# EasyEDA Pro project uven2-mk3-cc-driver-20x.eprj, schematic cc-driver
Board Name: cc-driver; Create Date: 2025-05-29; Page Name: P1; Project Name: uven2-mk3-cc-driver-20x; Schematic Name: cc-driver; Update Date: 2025-06-02; Company: EasyEDA.com; Page Size: A4; Version: V1.0
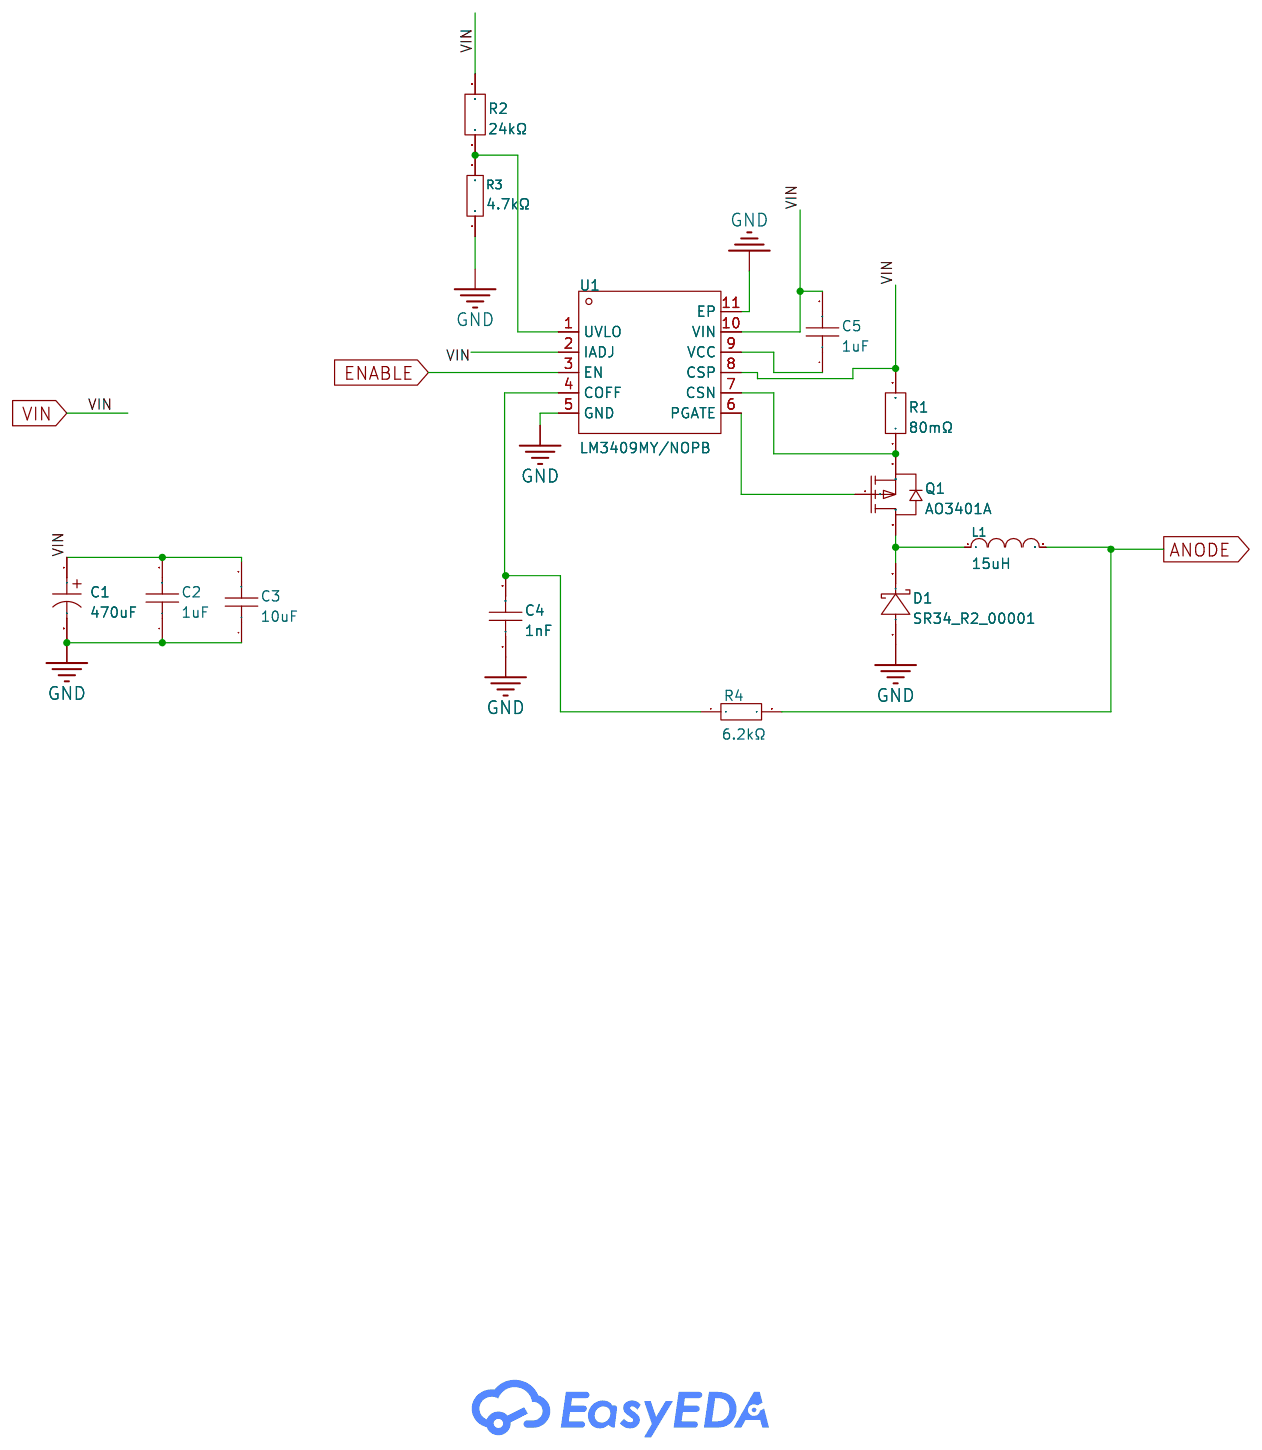
[diagram p0: schematic sheet]

## Parts
C1  470uF  [CAP-SMD_BD8.0-L8.3-W8.3-LS9.1-FD]
C2  1uF  [C0603]
C3  10uF  [C0805]
C4  1nF  [C0402]
C5  1uF  [C0603]
D1  SR34_R2_00001  [SMB_L4.3-W3.6-LS5.4-R-RD]
L1  15uH  [IND-SMD_L8.0-W8.0-HPC8040NF-150M]
Q1  AO3401A  [SOT-23-3_L2.9-W1.3-P1.90-LS2.4-BR]
R1  80mΩ  [RES-SMD_L6.4-W3.2-1]
R2  24kΩ  [R0402]
R3  4.7kΩ  [R0402]
R4  6.2kΩ  [R0402]
U1  LM3409MY/NOPB  [HVSSOP-10_L3.0-W3.0-P0.50-LS4.9-BL-EP]

## Library data of the parts
C1 = GVT1E477M0810CNVC: Capacitance:470uF Tolerance:±20% Tolerance:±20% Voltage Rating:25V Diameter:8mm Height - Seated (Max):10.5mm Lifetime:2000hrs@105℃ Operating Temperature:-55℃~+105℃ Operating Temperature:-55℃~+105℃; LCSC Part Name: 470uF ±20% 25V; Supplier Part: C2983319; Manufacturer: HRK(鸿瑞凯电子); Supplier Footprint: SMD,D8xL10.5mm; JLCPCB Part Class: Extended Part; Datasheet: https://atta.szlcsc.com/upload/public/pdf/source/20221207/309A0E7A4E93E57591E8CB40CFAF96D3.pdf; Supplier: LCSC; Tolerance: ±20%; Voltage Rating: 25V; Diameter: 8mm; Height - Seated (Max): 10.5mm; Lifetime: 2000hrs@105℃; Operating Temperature: -55℃~+105℃
C2 C5 = CL10A105KB8NNNC: Capacitance: Tolerance:±10% Tolerance:±10% Voltage Rated: Temperature Coefficient:; LCSC Part Name: 1uF ±10% 50V; Supplier Part: C15849; Manufacturer: SAMSUNG(三星); Supplier Footprint: 0603; JLCPCB Part Class: Basic Part; Datasheet: https://atta.szlcsc.com/upload/public/pdf/source/20160218/1457707763339.pdf; Supplier: LCSC; Tolerance: ±10%
C3 = GRM21BR61H106KE43L: Capacitance: Tolerance:±10% Tolerance:±10% Voltage Rated: Temperature Coefficient:; LCSC Part Name: 10uF ±10% 50V; Supplier Part: C440198; Manufacturer: muRata(村田); Supplier Footprint: 0805; JLCPCB Part Class: Basic Part; Datasheet: https://atta.szlcsc.com/upload/public/pdf/source/20230811/95AAE0C9AF55EDC31B7A4D8B733F534E.pdf; Supplier: LCSC; Tolerance: ±10%
C4 = TCC0402X7R102M500AT: Capacitance:1000pF Tolerance:±20% Tolerance:±20% Voltage Rating:50V Temperature Coefficient:X7R; LCSC Part Name: 1nF ±20% 50V; Supplier Part: C696907; Manufacturer: CCTC(三环); Supplier Footprint: 0402; JLCPCB Part Class: Extended Part; Datasheet: https://atta.szlcsc.com/upload/public/pdf/source/20200707/C696841_89A2C111301AB76AE7642008585E7A11.pdf; Supplier: LCSC; Tolerance: ±20%; Voltage Rating: 50V; Temperature Coefficient: X7R
D1 = SR34_R2_00001: Diode Configuration:Independent Type Forward Voltage (Vf@If):500mV@5A Reverse Voltage (Vr):40V Rectified Current:3A Reverse Leakage Current (Ir):200uA@40V; LCSC Part Name: 电压:40V 电流:3A; Supplier Part: C391712; Manufacturer: PANJIT(强茂); Supplier Footprint: SMB; JLCPCB Part Class: Extended Part; Datasheet: https://atta.szlcsc.com/upload/public/pdf/source/20200904/C391712_B432CC20561232D88205F89496125F85.pdf; Supplier: LCSC; Diode Configuration: Independent Type; Forward Voltage (Vf@If): 500mV@5A; Reverse Voltage (Vr): 40V; Rectified Current: 3A; Reverse Leakage Current (Ir): 200uA@40V
L1 = HPC8040NF-150M: Inductance: Tolerance:±20% Tolerance:±20% Rated Current: DC Resistance (DCR):; LCSC Part Name: 15uH ±20%; Supplier Part: C357081; Manufacturer: TAI-TECH(台庆); Supplier Footprint: SMD; JLCPCB Part Class: Extended Part; Datasheet: https://atta.szlcsc.com/upload/public/pdf/source/20200917/C357081_4A67B6405062159579418D5590B6376F.pdf; Supplier: LCSC; Tolerance: ±20%
Q1 = AO3401A: Drain to Source Voltage:30V Current - Continuous Drain(Id):4.2A RDS(on):55mΩ@10V,4.2A Pd - Power Dissipation:1.2W Gate Threshold Voltage (Vgs(th)@Id):- Gate Charge(Qg):8.5nC Input Capacitance(Ciss@Vds):880pF@15V Reverse Transfer Capacitance (Crss@Vds):65p; LCSC Part Name: 耐压:30V 电流:4.2A; Supplier Part: C5122001; Manufacturer: TECH PUBLIC(台舟); Supplier Footprint: SOT-23; JLCPCB Part Class: Extended Part; Datasheet: https://atta.szlcsc.com/upload/public/pdf/source/20220811/208673706F46EF46E2E13D7F68870739.pdf; Supplier: LCSC; Drain to Source Voltage: 30V; Current - Continuous Drain(Id): 4.2A; RDS(on): 55mΩ@10V,4.2A; Pd - Power Dissipation: 1.2W; Gate Charge(Qg): 8.5nC; Input Capacitance(Ciss@Vds): 880pF@15V; Reverse Transfer Capacitance (Crss@Vds): 65pF@15V; Operating Temperature: -55℃~+150℃
R1 = RLP25FEGR080: Resistance: Tolerance:±1% Tolerance:±1% Power(Watts): Temperature Coefficient:±50ppm/℃ Temperature Coefficient:±50ppm/℃; LCSC Part Name: 80mΩ ±1% 3W 合金电阻; Supplier Part: C459690; Manufacturer: 大毅科技; Supplier Footprint: 2512; JLCPCB Part Class: Extended Part; Datasheet: https://atta.szlcsc.com/upload/public/pdf/source/20191209/C467441_D59F70B0A5C6980F35DB1CB3CCA97CC4.pdf; Supplier: LCSC; Tolerance: ±1%; Temperature Coefficient: ±50ppm/℃
R2 = FRC0402F2402TS: Type:Thick Film Resistors Resistance:24kΩ Tolerance:±1% Tolerance:±1% Power(Watts): Voltage-Supply(Max): Temperature Coefficient:±100ppm/℃ Temperature Coefficient:±100ppm/℃ Operating Temperature:-55℃~+155℃ Operating Temperature:-55℃~+155℃; LCSC Part Name: 24kΩ ±1% 62.5mW 厚膜电阻; Supplier Part: C2933082; Manufacturer: FOJAN(富捷); Supplier Footprint: 0402; JLCPCB Part Class: Extended Part; Datasheet: https://atta.szlcsc.com/upload/public/pdf/source/20211221/925EC7D7225764EE0046F22065062C87.pdf; Supplier: LCSC; Type: Thick Film Resistors; Tolerance: ±1%; Temperature Coefficient: ±100ppm/℃; Operating Temperature: -55℃~+155℃
R3 = 0402WGJ0472TCE: Type:Thick Film Resistors Resistance:4.7kΩ Tolerance:±5% Tolerance:±5% Power(Watts): Overload Voltage (Max): Temperature Coefficient:±100ppm/℃ Temperature Coefficient:±100ppm/℃ Operating Temperature Range:-55℃~+155℃ Operating Temperature Range:-55℃~+155℃; LCSC Part Name: 4.7kΩ ±5% 62.5mW 厚膜电阻; Supplier Part: C25940; Manufacturer: UNI-ROYAL(厚声); Supplier Footprint: 0402; JLCPCB Part Class: Extended Part; Datasheet: https://atta.szlcsc.com/upload/public/pdf/source/20200306/C422600_1E6D84923E4A46A82E41ADD87F860B5C.pdf; Supplier: LCSC; Type: Thick Film Resistors; Tolerance: ±5%; Temperature Coefficient: ±100ppm/℃; Operating Temperature Range: -55℃~+155℃
R4 = RC0402FR-076K2L: Type:Thick Film Resistors Resistance: Tolerance:±1% Tolerance:±1% Power(Watts): Overload Voltage (Max): Temperature Coefficient:±100ppm/℃ Temperature Coefficient:±100ppm/℃ Operating Temperature Range:-55℃~+155℃ Operating Temperature Range:-55℃~+155℃; LCSC Part Name: 厚膜电阻 6.2kΩ ±1% 62.5mW; Supplier Part: C137946; Manufacturer: YAGEO(国巨); Supplier Footprint: 0402; JLCPCB Part Class: Extended Part; Datasheet: https://atta.szlcsc.com/upload/public/pdf/source/20181009/C309620_DA5935B6E1D48212CB7A533FE518B3C2.pdf; Supplier: LCSC; Type: Thick Film Resistors; Tolerance: ±1%; Temperature Coefficient: ±100ppm/℃; Operating Temperature Range: -55℃~+155℃
U1 = LM3409MY/NOPB: Frequency - Switching:- Frequency - Switching:- Number of Channels:1 Dimming:PWM；Analog Topology:Step-down Operating temperature:-40℃~+125℃ Operating temperature:-40℃~+125℃; Supplier Part: C527401; Manufacturer: TI(德州仪器); Supplier Footprint: HVSSOP-10-EP-0.5mm; JLCPCB Part Class: Extended Part; Datasheet: https://www.ti.com/cn/lit/gpn/lm3409; Supplier: LCSC; Number of Channels: 1; Dimming: PWM；Analog; Topology: Step-down; Operating temperature: -40℃~+125℃

## Nets
GND: C1.2 C2.1 C3.1 C4.1 D1.1(A) R3.1 U1.5(GND) U1.11(EP)
VIN: C1.1 C2.2 C3.2 C5.2 R1.2 R2.2 U1.2(IADJ) U1.8(CSP) U1.10(VIN)
ANODE: L1.2 R4.2
ENABLE: U1.3(EN)
$1N1417: C5.1 U1.9(VCC)
$1N1421: R2.1 R3.2 U1.1(UVLO)
$1N1440: Q1.2(S) R1.1 U1.7(CSN)
$1N1457: C4.2 R4.1 U1.4(COFF)
$1N1463: Q1.1(G) U1.6(PGATE)
$1N1464: D1.2(K) L1.1 Q1.3(D)
